# Altium schematic sheet smf_control.SchDoc
size A
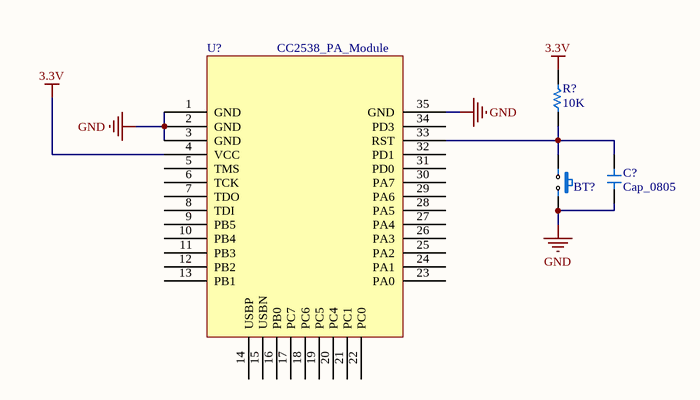
[diagram p0: smf_control.SchDoc]

## Parts
BT?  Button SMD 2 Pin  (value not drawn)
C?  Cap_0805  [CAP_0805_SMD]
R?  10K  [RES_0805]
U?  CC2538_PA_Module

## Nets
3.3V: R?.2 U?.4(VCC)
GND: BT?.2 C?.1 U?.1(GND) U?.2(GND) U?.3(GND) U?.35(GND)
NetBT?_1: BT?.1 C?.2 R?.1 U?.33(RST)

Not connected (* = marked no-connect by the designer): U? 5(TMS) 6(TCK) 7(TDO) 8(TDI) 9(PB5) 10(PB4) 11(PB3) 12(PB2) 13(PB1) 14(USBP) 15(USBN) 16(PB0) 17(PC7) 18(PC6) 19(PC5) 20(PC4) 21(PC1) 22(PC0) 23(PA0) 24(PA1) 25(PA2) 26(PA3) 27(PA4) 28(PA5) 29(PA6) 30(PA7) 31(PD0) 32(PD1) 34(PD3)

## Library data of the parts
R? = Res_0805